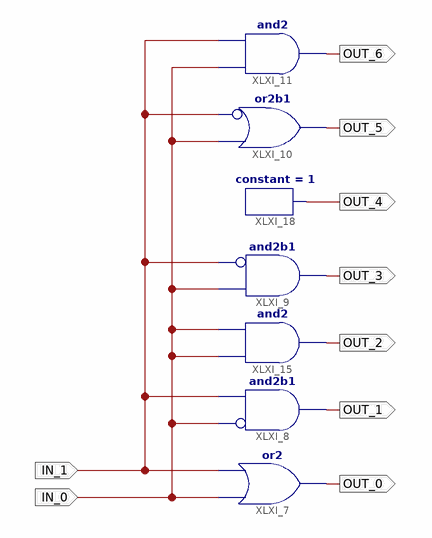
[diagram p0: schematic sheet 1]
// Xilinx ISE schematic lab_1.sch (spartan3a) as structural Verilog: 7 symbols, 9 ports
module lab_1 (
  input  IN_1,
  input  IN_0,
  output OUT_0,
  output OUT_1,
  output OUT_3,
  output OUT_5,
  output OUT_6,
  output OUT_4,
  output OUT_2
);

  or XLXI_7 (OUT_0, IN_0, IN_1);
  and XLXI_8 (OUT_1, ~IN_0, IN_1);  // and2b1
  and XLXI_9 (OUT_3, ~IN_1, IN_0);  // and2b1
  and XLXI_11 (OUT_6, IN_0, IN_1);
  or XLXI_10 (OUT_5, ~IN_1, IN_0);  // or2b1
  and XLXI_15 (OUT_2, IN_0, IN_0);
  constant #(.CValue("1")) XLXI_18 (.O(OUT_4));
endmodule
